# EAGLE schematic ECE445-Transmitter-Schematic-Oscillator (EAGLE 7.5.0)
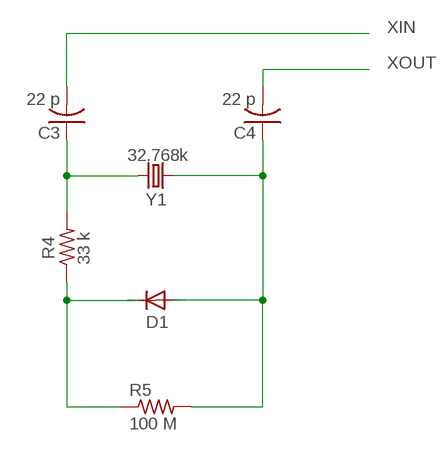
[diagram p0: schematic, sheet 1]

## Parts
C3  22 p  C-US025-024X044  [C025-024X044]
C4  22 p  C-US025-024X044  [C025-024X044]
D1  1N4004  [DO41-10]
R4  33 k  R-US_0204/2V  [0204V]
R5  100 M  R-US_0204/2V  [0204V]
Y1  32.768k  CRYSTAL32-SMD-MELF  [CRYSTAL-32KHZ-SMD-MELF]

## Nets
N$6: C3.1 R4.2 Y1.X2
N$8: D1.C R4.1 R5.1
N$12: C4.1 D1.A R5.2 Y1.X1
XIN: C3.2
XOUT: C4.2

## Library data of the parts
C3 C4 = rcl:C-US: CAPACITOR, American symbol
D1 = diode:1N4004: DIODE general purpose rectifier, 1 A
R4 R5 = rcl:R-US_: RESISTOR, American symbol
Y1 = SparkFun-FreqCtrl:CRYSTAL: Various standard crystals. Proven footprints.; PROD_ID: XTAL-07894